# EAGLE design CHIP_dispv1.0 (EAGLE 7.6.0)
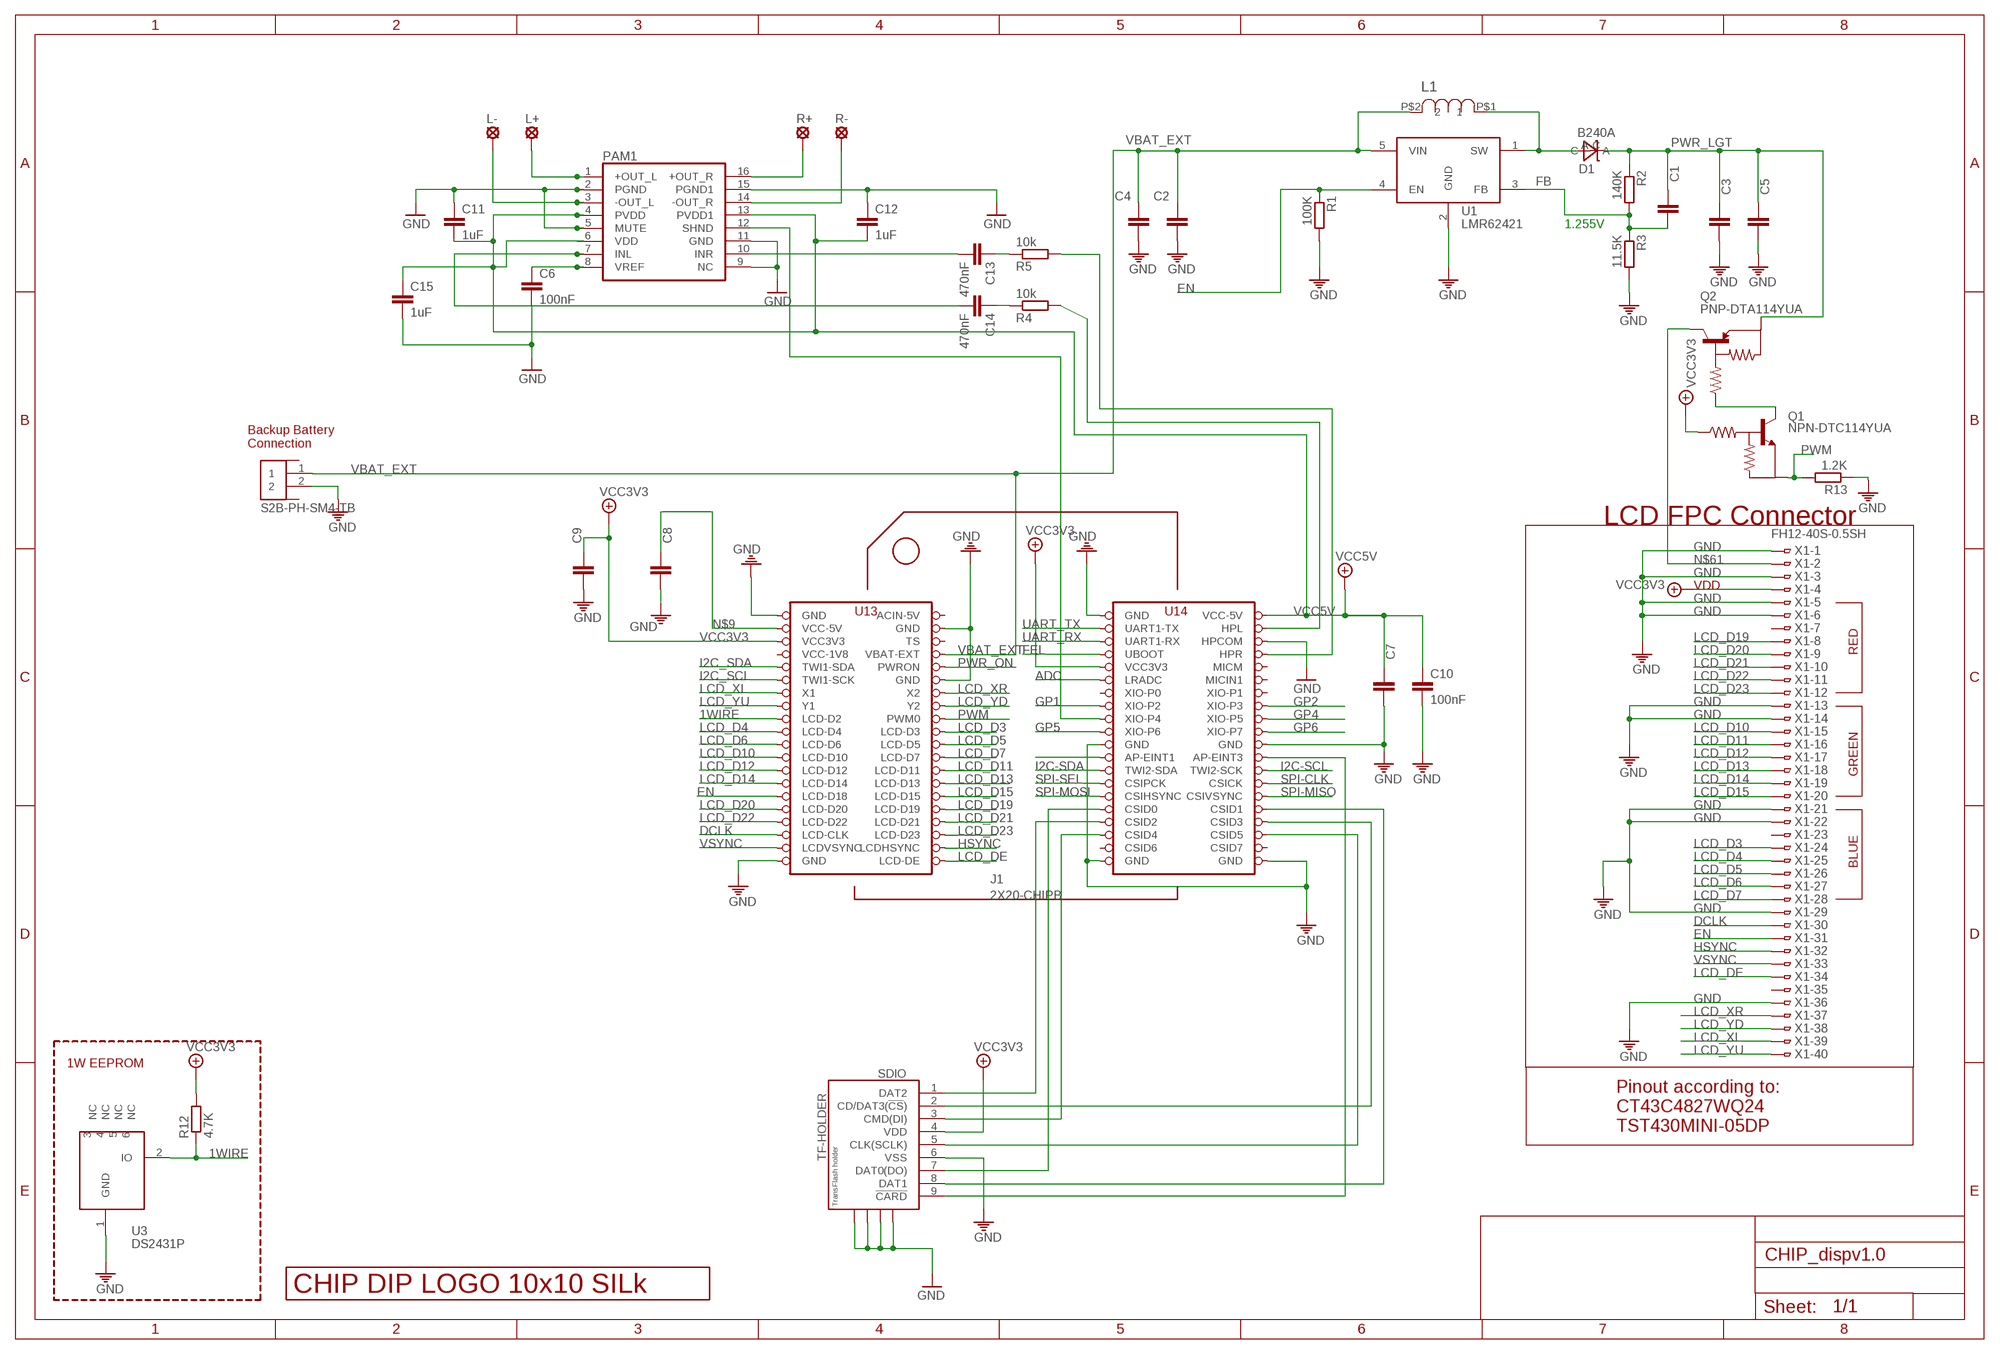
[diagram p0: schematic, sheet 1]

## Parts
C1  220pF  C-EUC0805  [C0805]
C2  100nF  C-EUC0805  [C0805]
C3  100nF  C-EUC0805  [C0805]
C4  22uF  C-EUC0805  [C0805]
C5  22uF  C-EUC0805  [C0805]
C6  100nF  C-EUC0805  [C0805]
C7  22uF  C-EUC0805  [C0805]
C8  100nF  C-EUC0805  [C0805]
C9  100nF  C-EUC0805  [C0805]
C10  100nF  C-EUC0805  [C0805]
C11  1uF  C-EUC0805  [C0805]
C12  1uF  C-EUC0805  [C0805]
C13  470nF  C-EUC0805  [C0805]
C14  470nF  C-EUC0805  [C0805]
C15  1uF  C-EUC0805  [C0805]
D1  B240A  DIODE_SCHTKY_B240  [DO-214AC]
J1  2X20-CHIPB  [2X20CHIP_SM]
J3  S2B-PH-SM4-TB  [S2B-PH-SM4-TB]
L1  SRN6045-100M  [SRN6045]
L+  SE11  [SE11]
L-  SE11  [SE11]
PAM1  PAM8403  [SOP-16]
Q1  NPN-DTC114YUA  [SOT323]
Q2  PNP-DTA114YUA  [SOT323]
R1  100K  R-EU_M0805  [M0805]
R2  140K  R-EU_M0805  [M0805]
R3  11.5K  R-EU_M0805  [M0805]
R4  10k  R-EU_R0805  [R0805]
R5  10k  R-EU_R0805  [R0805]
R12  4.7K  R-EU_M0805  [M0805]
R13  1.2K  R-EU_M0805  [M0805]
R+  SE11  [SE11]
R-  SE11  [SE11]
SDIO  TF-HOLDER  [TF-PULL]
U1  LMR62421  [SOT23-5]
U3  DS2431P  [TSOC6]
U$2  LOGO_10X10_SILK  [LOGO2_10X10_SILK]
X1  FH12-40S-0.5SH  [FH12-40S-0.5SH]

## Nets
1WIRE: J1.LCD-D2 R12.1 U3.2(IO)
ADC: J1.LRADC
DCLK: J1.LCD-CLK X1.30
EN: J1.LCD-D18 R1.1 U1.4(EN) X1.31
FB: C1.2 R2.2 R3.1 U1.3(FB)
FEL: J1.FEL(UBOOT)
GND: C2.2 C3.2 C4.2 C5.2 C6.2 C7.2 C8.2 C9.2 C10.2 C11.1 C12.1 C15.2 J1.GND@1(GND) J1.GND@2(GND) J1.GND@3(GND) J1.GND@4(GND) J1.GND@5(GND) J1.GND@6(GND) J1.GND@7(GND) J1.GND@8(GND) J1.GND@10(GND) J1.HPCOM J3.2 PAM1.2(PGND) PAM1.5(MUTE) PAM1.9(NC) PAM1.11(GND) PAM1.15(PGND1) R1.2 R3.2 R13.1 SDIO.6(VSS) SDIO.S1 SDIO.S2 SDIO.S3 SDIO.S4 U1.2(GND) U3.1(GND) X1.1 X1.3 X1.5 X1.6 X1.13 X1.14 X1.21 X1.22 X1.29 X1.36
GP1: J1.XIO-P2
GP2: J1.XIO-P3
GP3: J1.XIO-P4 PAM1.12(SHND)
GP4: J1.XIO-P5
GP5: J1.XIO-P6
GP6: J1.XIO-P7
HSYNC: J1.LCD-HSYNC(LCDHSYNC) X1.32
I2C-SCL: J1.TWI2-SCK
I2C-SDA: J1.TWI2-SDA
I2C_SCL: J1.TWI1-SCK
I2C_SDA: J1.TWI1-SDA
KPD_INT: J1.AP-EINT1
LCD_D3: J1.LCD-D3 X1.24
LCD_D4: J1.LCD-D4 X1.25
LCD_D5: J1.LCD-D5 X1.26
LCD_D6: J1.LCD-D6 X1.27
LCD_D7: J1.LCD-D7 X1.28
LCD_D10: J1.LCD-D10 X1.15
LCD_D11: J1.LCD-D11 X1.16
LCD_D12: J1.LCD-D12 X1.17
LCD_D13: J1.LCD-D13 X1.18
LCD_D14: J1.LCD-D14 X1.19
LCD_D15: J1.LCD-D15 X1.20
LCD_D19: J1.LCD-D19 X1.8
LCD_D20: J1.LCD-D20 X1.9
LCD_D21: J1.LCD-D21 X1.10
LCD_D22: J1.LCD-D22 X1.11
LCD_D23: J1.LCD-D23 X1.12
LCD_DE: J1.LCD-DE X1.34
LCD_XL: J1.X1 X1.39
LCD_XR: J1.X2 X1.37
LCD_YD: J1.Y2 X1.38
LCD_YU: J1.Y1 X1.40
N$1: J1.CSID0 SDIO.7(DAT0(DO))
N$9: C8.1 J1.VCC5V@0(VCC-5V)
N$25: J1.CSID4 SDIO.3(CMD(DI))
N$27: J1.CSID1 SDIO.8(DAT1)
N$28: J1.CSID3 SDIO.2(CD/DAT3(!CS!))
N$31: J1.CSID2 SDIO.1(DAT2)
N$32: L+.MP PAM1.1(+OUT_L)
N$33: L-.MP PAM1.3(-OUT_L)
N$34: PAM1.16(+OUT_R) R+.MP
N$35: PAM1.14(-OUT_R) R-.MP
N$36: C14.2 PAM1.7(INL)
N$37: J1.HPR R5.2
N$38: C6.1 PAM1.8(VREF)
N$39: C13.2 PAM1.10(INR)
N$40: J1.HPL R4.2
N$41: C13.1 R5.1
N$42: C14.1 R4.1
N$44: J1.CSID5 SDIO.5(CLK(SCLK))
N$45: J1.AP-EINT3 SDIO.9(!CARD)
N$61: Q2.3(OUT) X1.2
N$63: Q1.3(OUT) Q2.1(IN)
PWM: J1.PWM0 Q1.2(GND) R13.2
PWR_LGT: C1.1 C3.1 C5.1 D1.C Q2.2(GND) R2.1
PWR_ON: J1.PWRON
SPI-CLK: J1.CSICK
SPI-MISO: J1.CSIVSYNC
SPI-MOSI: J1.CSIHSYNC
SPI-SEL: J1.CSIPCK
UART_RX: J1.UART1-RX
UART_TX: J1.UART1-TX
VBAT_EXT: C2.1 C4.1 J1.BAT(VBAT-EXT) J3.1 L1.P$2 U1.5(VIN)
VCC3V3: C9.1 J1.VCC3V3 J1.VCC3V3@1(VCC3V3) Q1.1(IN) R12.2 SDIO.4(VDD) X1.4
VCC5V: C7.1 C10.1 C11.2 C12.2 C15.1 J1.VCC5V@1(VCC-5V) PAM1.4(PVDD) PAM1.6(VDD) PAM1.13(PVDD1)
VREG_OUTPUT: D1.A L1.P$1 U1.1(SW)
VSYNC: J1.LCD-VSYNC(LCDVSYNC) X1.33
Unconnected: J1.CHG-IN(ACIN-5V) J1.CSID6 J1.CSID7 J1.MICIN1 J1.MICM J1.TS J1.XIO-P0 J1.XIO-P1 J3.MNT1 J3.MNT2 U3.3(NC) U3.4(NC) U3.5(NC) U3.6(NC) X1.7 X1.23 X1.35

## Notes on the sheet
- 1.255V
- Backup Battery
  Connection
- LCD FPC Connector
- VDD
- RED
- GREEN
- BLUE
- 1W EEPROM
- Pinout according to:
  CT43C4827WQ24
  TST430MINI-05DP

## Power pins joined to a net without a drawn wire
VCC-1V8: J1.VCC1V8(VCC-1V8)

## Library data of the parts
C1-C15 = rcl:C-EU: CAPACITOR, European symbol
D1 = Keyboard v0_5:DIODE_SCHTKY_B240; DESCRIPTION: DIODE SMD General Purpose 400V 1A 1.4W RoHS DO-214AC; FOOTPRINT: DO-214AC; LINK: http://www.digikey.com/product-detail/en/B240A-13-F/B240A-FDICT-ND/717810; MFG: DIGIKEY; MFG_PN: B240A-FDICT-ND; PART_TYPE: DIODE; PRICE: 0.11; VENDOR: DIODES; VENDOR_PART_NUMBER: B240A-13-F
J1 = JKW_CHIP:2X20-CHIP: Through hole layout with chip reference
J3 = Keyboard v0_5:S2B-PH-SM4-TB; DESCRIPTION: 2 pin con, 2MM RA, SMD; FOOTPRINT: S2B-PH-SM4-TB; LINK: http://www.digikey.com/product-detail/en/S2B-PH-SM4-TB(LF)(SN)/455-1749-1-ND/926846; MFG: DIGIKEY; MFG_PN: 455-1749-1-ND; PART_TYPE: CON; PRICE: 0.26; VENDOR: JST; VENDOR_PART_NUMBER: S2B-PH-SM4-TB(LF)(SN)
L1 = Keyboard v0_5:SRN6045-100M; DESCRIPTION: power inductor 10uH 2.5A 58.6 mohm; FOOTPRINT: SRN6045; LINK: http://www.digikey.com/product-detail/en/SRN6045-100M/SRN6045-100MTR-ND/2756120; MFG: DIGIKEY; MFG_PN: SRN6045-100MTR-ND; PART_TYPE: IND; PRICE: 0.15; TOLLERANCE: ±20%; VENDOR: BOURNS; VENDOR_PART_NUMBER: SRN6045-100M
L+ L- R+ R- = solpad:SE11: SOLDER PAD RTM, drill 1,1mm, distributor Buerklin, 07F810
PAM1 = JKW_CHIP:PAM8403: Dual channel audio amplifier IC - PAM8403
Q1 = PocketCHIP-Components-v0.72:NPN-DTC114YUA
Q2 = PocketCHIP-Components-v0.72:PNP-DTA114YUA
R1-R5 R12 R13 = rcl:R-EU_: RESISTOR, European symbol
SDIO = JKW_CHIP:TF-HOLDER: TF / Micro SD socket is PUSH-PUSH type, the card can be pushed into and auto locked and pushed out by simply press the card. Surface Mounting type.
U1 = PocketCHIP-Components-v0.7:LMR62421; DESCRIPTION: dc/dc step up, 2.1A, 1.6mhz, SOT-23-5; FOOTPRINT: SOT23-5; LINK: http://www.digikey.com/product-detail/en/LMR62421XMFE%2FNOPB/LMR62421XMFE%2FNOPBCT-ND/2777085; MFG: DIGIKEY; MFG_PN: LMR62421XMFE/NOPBCT-ND; PART_TYPE: IC; PRICE: 0.8; VENDOR: TEXAS INSTRUMENTS; VENDOR_PART_NUMBER: LMR62421XMFE/NOPB
U3 = Keyboard v0_5:DS2431: 1024-Bit EEPROM This chip provides a 4x256 Bit EEPROM, which can be programmed@5V. Write protection and OTP emulation are available, too. Author: Jan Kandziora <jjj@gmx.de>; DESCRIPTION: IC, 1024-Bit, 1-Wire EEPROM, TSOC6; FOOTPRINT: TSOC6; LINK: http://www.digikey.com/product-detail/en/DS2431P%2BT%26R/DS2431P%2BT%26RCT-ND/3647900; MFG: DIGIKEY; MFG_PN: DS2431P+T&RCT-ND; PART_TYPE: IC; PRICE: 0.98; VENDOR: MAXIM; VENDOR_PART_NUMBER: DS2431P+T&R
U$2 = JKW_CHIP:LOGO_10X10_SILK
X1 = Keyboard v0_5:FH12-40S-0.5S: 0.5mm Pitch Connectors For FPC/FFC Source: Data sheet <http://www.hirose.co.jp/cataloge_hp/e58605370.pdf>; DESCRIPTION: CON ffc smd, bottom contact 40pos, 0.50mm R/A; FOOTPRINT: FH12-40S-0.5SH; LINK: http://www.digikey.com/product-detail/en/FH12-40S-0.5SH(55)/HFJ140CT-ND/1110388; MFG: DIGIKEY; MFG_PN: HFJ140CT-ND; VENDOR: HIROSE; VENDOR_PART_NUMBER: FH12-40S-0.5SH(55)

## Board
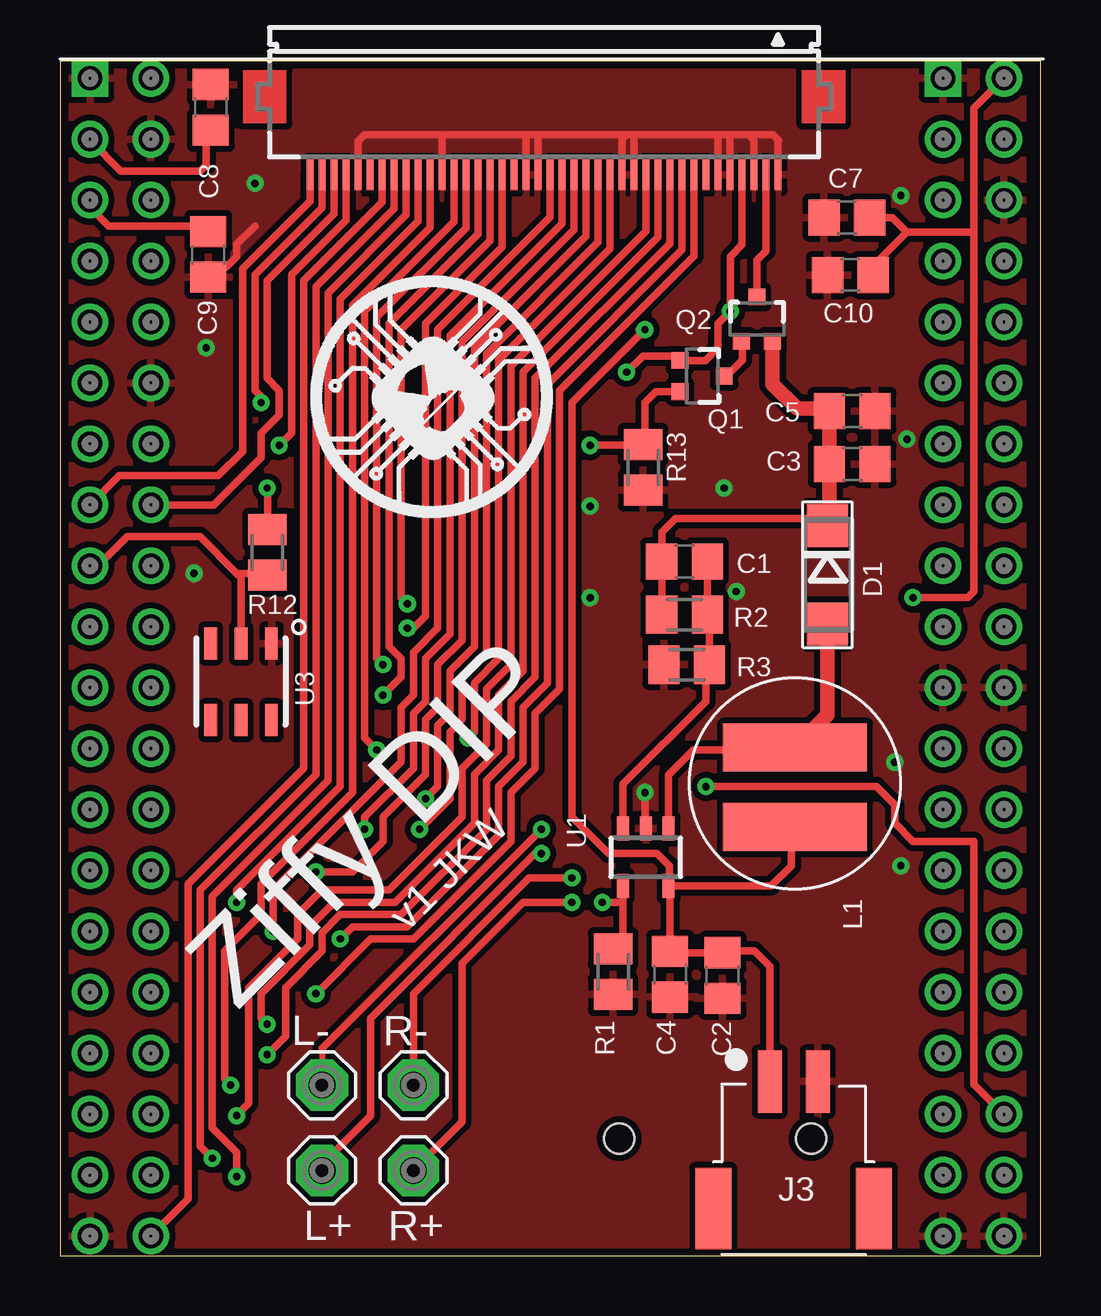
[diagram p1: board, top side]
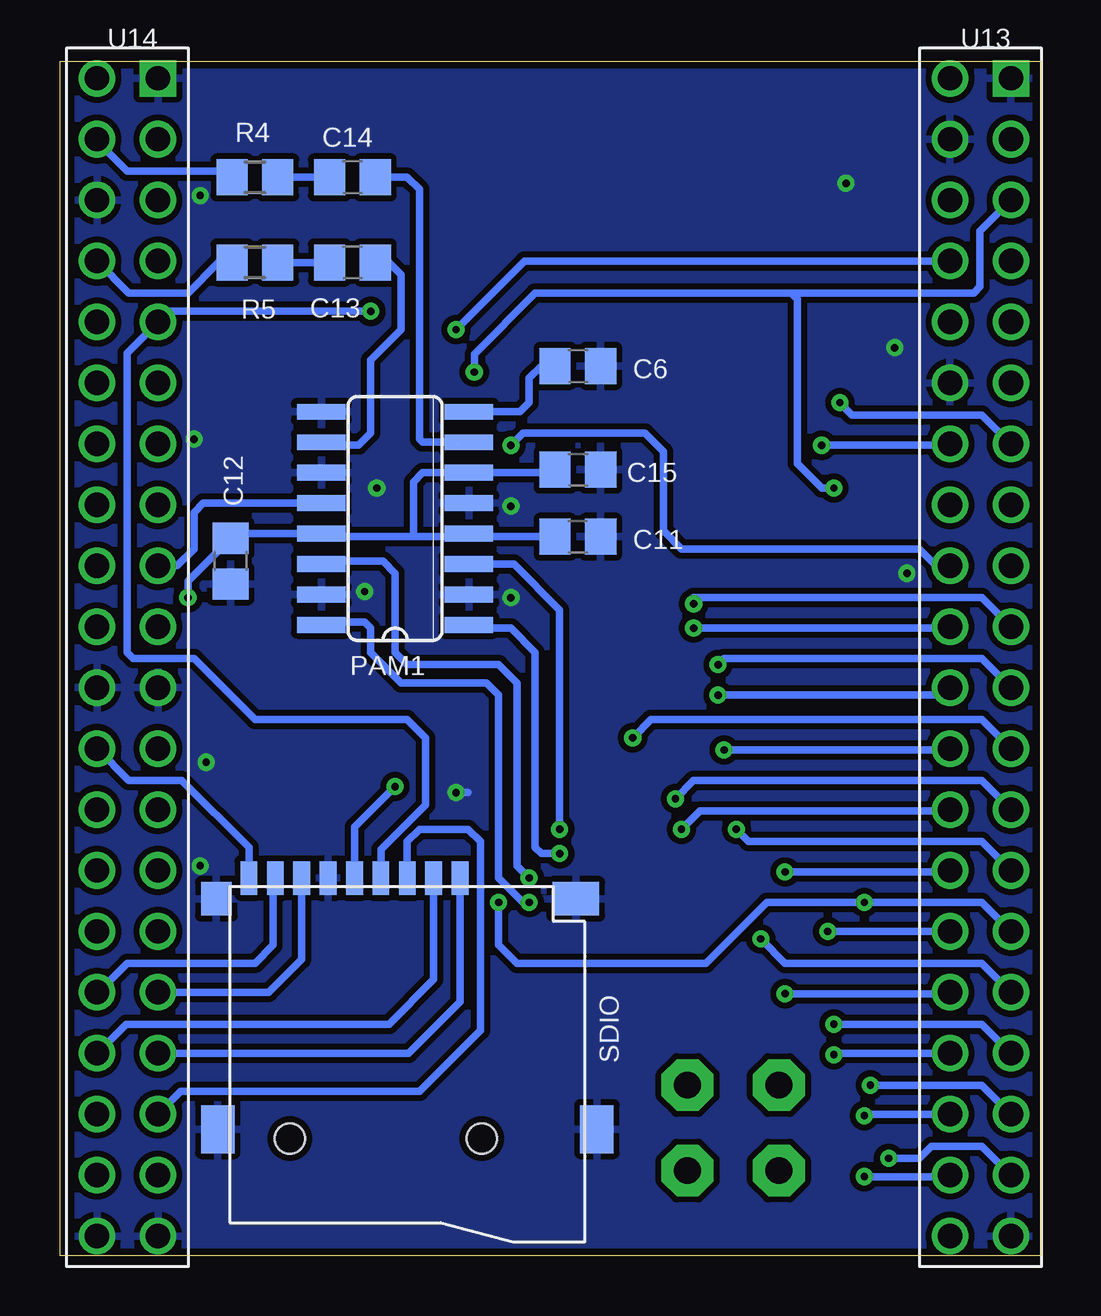
[diagram p2: board, bottom side, seen from below]

Size 40.89 x 49.78 mm. Coordinates in mm from the lower left corner, seen from the top.
Outline: 0,0 40.89,0 40.89,49.78 0,49.78 0,0
Copper layers (1*2*15*16): Top 0.035mm / dielectric 0.2mm / Route2 0.035mm / dielectric 0.2mm / Route15 0.035mm / dielectric 0.2mm / Bottom 0.035mm
Design rules "Hampoo *": minimum track width 3mil, minimum drill 8mil, track to track 3mil, track to pad 3mil, pad to pad 3mil, via to via 3mil, smd to smd 3mil, copper to edge 12mil, drill to drill 8mil, minimum pad ring 10mil, minimum via ring 8mil, stop-mask expansion 4mil, vias tented up to drill 24mil, thermal gap 10mil

### Footprints (pad centres in the part's own frame; a part is rotated, then mirrored left to right if it is on the bottom)
C0805 = smd 1.3 x 1.5: 1 -0.95,0; 2 0.95,0
DO-214AC = smd 1.8 x 1.7: A 2.05,0; C -2.05,0
2X20CHIP_SM = drill 1.016: AP-EINT1 36.81,21.65; AP-EINT3 39.35,21.65; BAT 3.79,41.97; CHG-IN 3.79,49.59; CSICK 39.35,16.57; CSID0 36.81,11.49; CSID1 39.35,11.49; CSID2 36.81,8.95; CSID3 39.35,8.95; CSID4 36.81,6.41; CSID5 39.35,6.41; CSID6 36.81,3.87; CSID7 39.35,3.87; CSIHSYNC 36.81,14.03; CSIPCK 36.81,16.57; CSIVSYNC 39.35,14.03; FEL 36.81,41.97; GND@1 3.79,36.89; GND@2 1.25,1.33; GND@4 39.35,24.19; GND@5 39.35,1.33; GND@6 36.81,1.33; GND@7 36.81,24.19; GND@10 3.79,47.05; HPCOM 39.35,44.51; HPL 39.35,47.05; HPR 39.35,41.97; LCD-CLK 1.25,6.41; LCD-D2 1.25,29.27; LCD-D3 3.79,26.73; LCD-D4 1.25,26.73; LCD-D5 3.79,24.19; LCD-D6 1.25,24.19; LCD-D7 3.79,21.65; LCD-D10 1.25,21.65; LCD-D11 3.79,19.11; LCD-D12 1.25,19.11; LCD-D13 3.79,16.57; LCD-D14 1.25,16.57; LCD-D15 3.79,14.03; LCD-D18 1.25,14.03; LCD-D19 3.79,11.49; LCD-D20 1.25,11.49; LCD-D21 3.79,8.95; LCD-D22 1.25,8.95; LCD-D23 3.79,6.41; LCD-DE 3.79,1.33; LCD-HSYNC 3.79,3.87; LCD-VSYNC 1.25,3.87; LRADC 36.81,36.89; MICIN1 39.35,36.89; MICM 39.35,39.43; PWM0 3.79,29.27; PWRON 3.79,39.43; TS 3.79,44.51; TWI1-SCK 1.25,36.89; TWI1-SDA 1.25,39.43; TWI2-SCK 39.35,19.11; TWI2-SDA 36.81,19.11; UART1-RX 36.81,44.51; UART1-TX 36.81,47.05; VCC1V8 1.25,41.97; VCC3V3 1.25,44.51; VCC3V3@1 36.81,39.43; VCC5V@0 1.25,47.05; VCC5V@1 39.35,49.59; X1 1.25,34.35; X2 3.79,34.35; XIO-P0 36.81,34.35; XIO-P1 39.35,34.35; XIO-P2 36.81,31.81; XIO-P3 39.35,31.81; XIO-P4 36.81,29.27; XIO-P5 39.35,29.27; XIO-P6 36.81,26.73; XIO-P7 39.35,26.73; Y1 1.25,31.81; Y2 3.79,31.81 | drill 1.016 square: GND@3 1.25,49.59; GND@8 36.81,49.59
S2B-PH-SM4-TB = smd 2.6 x 1: 1 0,-1; 2 0,1 | smd 3.4 x 1.5: MNT1 5.3,3.35; MNT2 5.3,-3.35
SRN6045 = smd 2 x 6: P$1 1.5,0; P$2 -1.8,0
SE11 = drill 1.118 pad 2.159 octagon: MP 0,0
SOP-16 = smd 0.66 x 2.032: 1 -4.445,-3.073; 2 -3.175,-3.073; 3 -1.905,-3.073; 4 -0.635,-3.073; 5 0.635,-3.073; 6 1.905,-3.073; 7 3.175,-3.073; 8 4.445,-3.073; 9 4.445,3.073; 10 3.175,3.073; 11 1.905,3.073; 12 0.635,3.073; 13 -0.635,3.073; 14 -1.905,3.073; 15 -3.175,3.073; 16 -4.445,3.073
SOT323 = smd 0.7 x 0.7: 1 -0.65,-0.925; 2 0.65,-0.925; 3 0,0.925
M0805 = smd 1.3 x 1.6: 1 -0.95,0; 2 0.95,0
R0805 = smd 1.3 x 1.5: 1 -0.95,0; 2 0.95,0
TF-PULL = smd 0.7 x 1.4: 1 -2.2,-7.62; 2 -1.1,-7.62; 3 0,-7.62; 4 1.1,-7.62; 5 2.2,-7.62; 6 3.3,-7.62; 7 4.4,-7.62; 8 5.5,-7.62; 9 6.6,-7.62 | smd 1.4 x 2: S1 -7.9,2.85; S2 7.9,2.85 | smd 1.28 x 1.4: S3 7.96,-6.75 | smd 1.95 x 1.4: S4 -7.025,-6.75 | hole 1.25: -3.1,3.25; 4.9,3.25
SOT23-5 = smd 0.5 x 1: 1 -0.95,-1.2; 2 0,-1.2; 3 0.95,-1.2; 4 0.95,1.2; 5 -0.95,1.2
TSOC6 = smd 0.53 x 1.33: 1 -1.27,-1.6; 2 0,-1.6; 3 1.27,-1.6; 4 1.27,1.6; 5 0,1.6; 6 -1.27,1.6
FH12-40S-0.5SH = smd 0.3 x 1.3: 1 -9.75,3.25; 2 -9.25,3.25; 3 -8.75,3.25; 4 -8.25,3.25; 5 -7.75,3.25; 6 -7.25,3.25; 7 -6.75,3.25; 8 -6.25,3.25; 9 -5.75,3.25; 10 -5.25,3.25; 11 -4.75,3.25; 12 -4.25,3.25; 13 -3.75,3.25; 14 -3.25,3.25; 15 -2.75,3.25; 16 -2.25,3.25; 17 -1.75,3.25; 18 -1.25,3.25; 19 -0.75,3.25; 20 -0.25,3.25; 21 0.25,3.25; 22 0.75,3.25; 23 1.25,3.25; 24 1.75,3.25; 25 2.25,3.25; 26 2.75,3.25; 27 3.25,3.25; 28 3.75,3.25; 29 4.25,3.25; 30 4.75,3.25; 31 5.25,3.25; 32 5.75,3.25; 33 6.25,3.25; 34 6.75,3.25; 35 7.25,3.25; 36 7.75,3.25; 37 8.25,3.25; 38 8.75,3.25; 39 9.25,3.25; 40 9.75,3.25

### Placement (x,y rotation side)
C1  26.04,28.94 0 top
C2  27.62,11.68 270 top
C3  33.02,33 0 top
C4  25.43,11.73 270 top
C5  33.02,35.21 0 top
C6  19.3,37.08 0 bottom
C7  32.8,43.27 180 top
C8  6.29,47.87 90 top
C9  6.18,41.74 270 top
C10  32.95,40.88 180 top
C11  19.3,29.97 180 bottom
C12  33.78,28.96 90 bottom
C13  28.7,41.4 0 bottom
C14  28.7,44.96 0 bottom
C15  19.3,32.77 0 bottom
D1  31.99,28.38 270 top
J1  0,-0.51 0 top
J3  30.59,7.26 270 top
L1  30.64,19.68 90 top
L+  10.92,3.56 180 top
L-  10.92,7.11 0 top
PAM1  26.92,30.73 90 bottom
Q1  26.76,36.67 270 top
Q2  29.05,39.04 0 top
R1  23.06,11.84 270 top
R2  26.04,26.73 0 top
R3  26.13,24.64 180 top
R4  32.77,44.96 180 bottom
R5  32.77,41.4 180 bottom
R12  8.65,29.32 90 top
R13  24.31,32.86 90 top
R+  14.73,3.56 180 top
R-  14.73,7.11 0 top
SDIO  26.42,8.13 180 bottom
U1  24.42,16.61 180 top
U3  7.55,23.93 180 top
U$2  15.49,28.7 45 top
X1  20.18,48.31 180 top

### Tracks (layer width: path | path; a pad name or v marks a point on that pad's centre or on a via)
1WIRE
  Top 0.305: J1.LCD-D2 1.58,28.76 2.79,29.97 5.84,29.97 7.37,28.45 | 7.37,28.45 8.57,28.45 R12.1 | U3.2 7.55,28.27 7.37,28.45
DCLK  (via drill 0.3)
  Top 0.305: X1.30 15.43,42.86 12.19,39.62 12.19,19.3 8.38,15.49 8.38,14.22 6.86,12.7 6.86,7.37 v7.11,7.11
  Bottom 0.305: v7.11,7.11 2.46,7.11 J1.LCD-CLK
EN  (via drill 0.3)
  Top 0.305: X1.31 14.93,43.12 11.68,39.88 11.68,19.56 7.37,15.24 v7.37,14.73 | R1.1 23.47,13.21 23.47,14.73 | 23.47,14.73 U1.4 | v22.61,14.73 23.47,14.73
  Bottom 0.305: J1.LCD-D18 2.46,14.73 v7.37,14.73 11.43,14.73 13.97,12.19 21.84,12.19 22.61,12.95 v22.61,14.73
FB
  Top 0.305: U1.3 23.47,19.66 26.92,23.11 26.92,24.48 R3.1 27.08,26.63 R2.2 C1.2
GND  (via drill 0.3)
  Top 0.305: X1.29 15.93,46.66 | 15.93,46.66 16,46.74 19.3,46.74 | 19.3,46.74 20.07,46.74 | 20.07,46.74 23.62,46.74 | 23.62,46.74 23.88,46.74 | 23.88,46.74 27.43,46.74 | 27.43,46.74 27.94,46.74 | 27.94,46.74 28.7,46.74 | 28.7,46.74 29.72,46.74 29.97,46.48 29.93,46.44 X1.1 | X1.3 28.93,46.51 28.7,46.74 | X1.6 27.43,46.73 27.43,46.74 | X1.5 27.93,46.73 27.94,46.74 | X1.14 23.43,46.54 23.62,46.74 | X1.13 23.93,46.68 23.88,46.74 | X1.22 19.43,46.61 19.3,46.74 | X1.21 19.93,46.6 20.07,46.74 | X1.36 12.43,46.47 12.7,46.74 15.86,46.74 15.93,46.66 | U1.2 24.38,17.84 v24.38,19.3 | C9.2 6.5,40.79 7.37,41.66 7.37,42.16 8.13,42.93
  Bottom 0.305: v24.38,19.3 23.88,19.3
  other vias: 34.8,20.57 27.69,32 5.59,28.45 6.1,37.85 28.19,27.69 35.31,34.04 22.1,31.24 22.1,27.43 8.13,44.7 35.05,16.26 35.05,44.2
  pour Bottom (isolate 0.254): 0.51,49.78 40.13,49.78 40.13,39.12 40.13,0.25 6.6,0.25 0.51,0.25
  pour Top (isolate 0.254): 0.51,49.78 40.13,49.78 40.13,45.21 40.13,0.25 32.51,0.25 0.51,0.25
GP3
  Bottom 0.305: PAM1.12 34.92,31.37 35.31,30.99 35.31,29.46 36.01,28.76 J1.XIO-P4
HSYNC  (via drill 0.3)
  Top 0.305: X1.32 14.43,43.39 11.18,40.13 11.18,19.81 6.35,14.99 6.35,5.33 7.37,4.32 v7.37,3.3
  Bottom 0.305: v7.37,3.3 3.85,3.3 J1.LCD-HSYNC
LCD_D3  (via drill 0.3)
  Top 0.305: X1.24 18.43,42.05 15.24,38.86 15.24,26.67 14.73,26.16 v14.48,26.16
  Bottom 0.305: v14.48,26.16 3.85,26.16 J1.LCD-D3
LCD_D4  (via drill 0.3)
  Top 0.305: X1.25 17.93,42.31 14.22,38.61 14.22,27.43 v14.48,27.18
  Bottom 0.305: v14.48,27.18 14.48,27.43 2.46,27.43 J1.LCD-D4
LCD_D5  (via drill 0.3)
  Top 0.305: X1.26 17.43,42.58 13.72,38.86 13.72,25.4 14.22,24.89 14.22,24.13 v13.46,23.37
  Bottom 0.305: v13.46,23.37 4.1,23.37 J1.LCD-D5
LCD_D6  (via drill 0.3)
  Top 0.305: X1.27 16.93,42.84 13.21,39.12 13.21,24.89 v13.46,24.64
  Bottom 0.305: v13.46,24.64 13.21,24.89 2.46,24.89 J1.LCD-D6
LCD_D7  (via drill 0.3)
  Top 0.305: X1.28 16.43,43.1 12.7,39.37 12.7,21.59 v13.21,21.08
  Bottom 0.305: v13.21,21.08 3.85,21.08 J1.LCD-D7
LCD_D10  (via drill 0.3)
  Top 0.305: X1.15 22.93,41.98 18.29,37.34 18.29,24.89 17.27,23.88 17.27,21.84 v17.02,21.59
  Bottom 0.305: v17.02,21.59 16.26,22.35 2.46,22.35 J1.LCD-D10
LCD_D11  (via drill 0.3)
  Top 0.305: X1.16 22.43,42.24 17.78,37.59 17.78,25.15 16.76,24.13 16.76,22.35 16.26,21.84 16.26,19.05 v14.99,17.78
  Bottom 0.305: v14.99,17.78 14.22,18.54 3.85,18.54 J1.LCD-D11
LCD_D12  (via drill 0.3)
  Top 0.305: X1.17 21.93,42.5 17.27,37.85 17.27,25.4 16.26,24.38 16.26,22.61 15.75,22.1 15.75,19.56 v15.24,19.05
  Bottom 0.305: v15.24,19.05 14.48,19.81 2.46,19.81 J1.LCD-D12
LCD_D13  (via drill 0.3)
  Top 0.305: X1.18 21.43,42.77 16.76,38.1 16.76,25.65 15.75,24.64 15.75,22.86 15.24,22.35 15.24,20.83 15.24,20.32 15.24,20.07 13.46,18.29 13.46,17.27 12.19,16 v10.67,16
  Bottom 0.305: J1.LCD-D13 3.85,16 v10.67,16
LCD_D14  (via drill 0.3)
  Top 0.305: X1.19 20.93,43.03 16.26,38.35 16.26,25.91 15.24,24.89 15.24,23.11 14.73,22.61 14.73,20.32 12.7,18.29 v12.7,17.78
  Bottom 0.305: v12.7,17.78 12.19,17.27 2.46,17.27 J1.LCD-D14
LCD_D15  (via drill 0.3)
  Top 0.305: X1.20 20.43,43.29 15.75,38.61 15.75,26.16 14.73,25.15 14.73,23.37 14.22,22.86 14.22,20.57 8.89,15.24 v8.89,13.52
  Bottom 0.305: v8.89,13.52 J1.LCD-D15
LCD_D19  (via drill 0.3)
  Top 0.305: X1.8 26.43,41.67 20.83,36.07 20.83,23.62 19.81,22.61 19.81,20.32 18.8,19.3 18.8,17.27 14.73,13.21 12.95,13.21 v10.67,10.92
  Bottom 0.305: v10.67,10.92 3.85,10.92 J1.LCD-D19
LCD_D20  (via drill 0.3)
  Top 0.305: X1.9 25.93,41.93 20.32,36.32 20.32,23.88 19.3,22.86 19.3,20.57 18.29,19.56 18.29,17.53 14.48,13.72 12.19,13.72 v11.68,13.21
  Bottom 0.305: J1.LCD-D20 2.46,12.19 10.67,12.19 v11.68,13.21
LCD_D21  (via drill 0.3)
  Top 0.305: X1.10 25.43,42.19 19.81,36.58 19.81,24.13 18.8,23.11 18.8,20.83 17.78,19.81 17.78,17.78 14.22,14.22 11.68,14.22 10.92,13.46 10.92,12.7 9.4,11.18 9.4,9.14 v8.64,8.38
  Bottom 0.305: v8.64,8.38 8.58,8.44 J1.LCD-D21
LCD_D22  (via drill 0.3)
  Top 0.305: X1.11 24.93,42.46 19.3,36.83 19.3,24.38 18.29,23.37 18.29,21.08 17.27,20.07 17.27,18.03 13.97,14.73 11.43,14.73 10.41,13.72 10.41,12.95 8.38,10.92 8.38,9.91 v8.64,9.65
  Bottom 0.305: J1.LCD-D22 2.46,9.65 v8.64,9.65
LCD_D23  (via drill 0.3)
  Top 0.305: X1.12 24.43,42.72 18.8,37.08 18.8,24.64 17.78,23.62 17.78,21.34 16.76,20.32 16.76,18.29 13.72,15.24 10.92,15.24 9.91,14.22 9.91,13.21 9.65,12.95 9.4,12.7 7.87,11.18 7.87,6.35 v7.37,5.84
  Bottom 0.305: 3.85,5.84 J1.LCD-D23 7.31,5.9 v7.37,5.84
LCD_DE
  Top 0.305: 3.85,0.76 J1.LCD-DE 5.33,2.37 5.33,15.49 10.16,20.32 10.16,40.64 13.43,43.91 X1.34
LCD_XL  (via drill 0.3)
  Top 0.305: X1.39 10.93,43.7 8.13,40.89 8.13,36.07 8.38,35.81 v8.38,35.56
  Bottom 0.305: v8.38,35.56 7.87,35.05 2.46,35.05 J1.X1
LCD_XR  (via drill 0.3)
  Top 0.305: X1.37 11.93,43.17 9.65,40.89 9.65,34.29 v9.14,33.78
  Bottom 0.305: v9.14,33.78 3.85,33.78 J1.X2
LCD_YD
  Top 0.305: X1.38 11.43,43.43 8.64,40.64 8.64,36.58 9.14,36.07 9.14,35.05 8.38,34.29 8.38,33.27 6.41,31.3 J1.Y2
LCD_YU
  Top 0.305: J1.Y1 2.46,32.51 6.6,32.51 7.62,33.53 7.62,41.15 10.43,43.96 X1.40
N$1
  Bottom 0.305: J1.CSID0 32.2,10.98 30.82,12.36 SDIO.7
N$9
  Top 0.305: J1.VCC5V@0 1.25,46.5 2.54,45.21 5.84,45.21 6.1,45.47 6.1,46.72 C8.1
N$25
  Bottom 0.305: J1.CSID4 35.85,6.86 25.91,6.86 23.37,9.4 23.37,17.27 23.88,17.78 25.91,17.78 26.42,17.27 SDIO.3
N$27
  Bottom 0.305: J1.CSID1 39.31,10.98 38.1,12.19 32.77,12.19 32,12.95 32,15.66 SDIO.8
N$28
  Bottom 0.305: J1.CSID3 38.14,9.65 27.18,9.65 25.32,11.51 SDIO.2
N$31
  Bottom 0.305: J1.CSID2 26.36,8.44 24.22,10.58 SDIO.1
N$32  (via drill 0.3)
  Top 0.305: v20.07,16.76 19.81,16.76 12.95,9.91 12.95,5.84 10.92,3.81 L+.MP
  Bottom 0.305: v20.07,16.76 20.83,16.76 21.08,17.02 21.08,25.15 22.1,26.16 23.72,26.16 PAM1.1
N$33  (via drill 0.3)
  Top 0.254: 10.92,8.64 L-.MP
  Top 0.305: 10.92,8.64 v20.07,17.78
  Bottom 0.305: v20.07,17.78 20.07,26.92 21.97,28.83 PAM1.3
N$34  (via drill 0.3)
  Top 0.305: v21.34,14.73 19.3,14.73 16.76,12.19 16.76,5.59 R+.MP
  Bottom 0.305: v21.34,14.73 21.59,14.73 22.61,15.75 22.61,23.37 23.11,23.88 26.67,23.88 27.94,25.15 27.94,26.16 28.19,26.42 29.87,26.42 PAM1.16
N$35  (via drill 0.3)
  Top 0.305: v21.34,15.75 19.56,15.75 14.73,10.92 R-.MP
  Bottom 0.305: v21.34,15.75 21.84,16.26 21.84,23.88 22.61,24.64 26.42,24.64 26.92,25.15 26.92,28.45 27.43,28.96 29.87,28.96 PAM1.14
N$36
  Bottom 0.305: PAM1.7 25.78,33.91 25.91,34.04 25.91,44.45 26.42,44.96 C14.2
N$37
  Bottom 0.305: 39.31,41.46 J1.HPR 38.02,40.13 35.56,40.13 34.29,41.4 R5.2
N$38
  Bottom 0.305: PAM1.8 21.72,35.18 21.34,35.56 21.34,36.58 20.83,37.08 C6.1
N$39
  Bottom 0.305: C13.2 27.18,41.4 26.67,40.89 26.67,38.61 27.94,37.34 27.94,34.29 28.45,33.78 29.87,33.78 PAM1.10
N$40
  Bottom 0.305: J1.HPL 39.35,46.46 38.1,45.21 33.97,45.21 R4.2
N$41
  Bottom 0.305: R5.1 C13.1
N$42
  Bottom 0.305: R4.1 C14.1
N$44  (via drill 0.3)
  Top 0.305: J1.CSID5 38.1,7.15 38.1,17.27 35.56,17.27 34.8,18.03 34.8,18.8 34.04,19.56 v26.92,19.56
  Bottom 0.305: SDIO.5 28.62,17.87 v26.92,19.56
N$45
  Bottom 0.305: SDIO.9 33.02,17.01 35.81,19.81 38.02,19.81 J1.AP-EINT3
N$61
  Top 0.305: X1.2 29.43,41.88 29.05,41.5 Q2.3
N$63
  Top 0.305: Q1.3 27.78,36.67 28.45,37.34 28.45,38.07 Q2.1
PWM  (via drill 0.3)  (1 unrouted)
  Top 0.305: Q1.2 24.84,36.02 24.38,35.56 24.38,33.89 R13.2 24.28,33.78 v22.1,33.78
  Bottom 0.305: J1.PWM0 4.38,28.76 5.08,29.46 14.99,29.46 15.75,30.23 15.75,33.53 16.51,34.29 21.59,34.29 v22.1,33.78 | 24.28,33.78 R13.2
PWR_LGT
  Top 0.305: R2.1 C1.1 25.08,30.17 25.65,30.73 31.69,30.73 D1.C
  Top 0.61: Q2.2 29.7,36.34 30.73,35.31 31.98,35.31 C5.1 C3.1 32.07,30.51 D1.C
VBAT_EXT  (via drill 0.3)
  Top 0.305: J3.1 29.59,12.07 28.96,12.7 27.68,12.7 C2.1 25.48,12.63 C4.1 25.43,15.34 U1.5 | U1.5 29.63,15.41 30.48,16.26 30.48,17.73 L1.P$2 | 24.13,38.61 v24.38,38.61 21.34,35.56 21.34,18.29 22.86,16.76 24.89,16.76 25.4,16.26 25.4,15.44 U1.5
  Bottom 0.305: J1.BAT 21.53,41.46 v24.38,38.61
VCC3V3  (via drill 0.3)
  Top 0.305: X1.4 28.43,42.15 27.94,41.66 v27.94,39.37 27.43,38.86 27.43,37.85 26.91,37.32 Q1.1 25.65,37.51 24.3,37.51 v23.62,36.83 | J1.VCC3V3 1.25,43.71 2.03,42.93 5.94,42.93 C9.1 | R12.2 8.65,31.99 v8.64,32
  Bottom 0.305: v27.94,39.37 36.36,39.37 J1.VCC3V3@1 38.1,37.63 38.1,25.15 37.85,24.89 35.31,24.89 32.77,22.35 26.42,22.35 25.65,21.59 25.65,18.8 27.52,16.93 SDIO.4 | v23.62,36.83 23.62,37.59 21.08,40.13 10.41,40.13 | 10.41,40.13 2.79,40.13 2.54,40.39 2.54,42.71 J1.VCC3V3 | v8.64,32 9.14,32 10.16,33.02 10.16,39.88 10.41,40.13
VCC5V  (via drill 0.3)
  Top 0.305: J1.VCC5V@1 38.1,47.83 38.1,42.67 | 38.1,42.67 38.1,27.69 37.85,27.43 v35.56,27.43 | C7.1 34.71,43.27 35.31,42.67 | 35.31,42.67 38.1,42.67 | C10.1 33.9,41.26 35.31,42.67
  Bottom 0.305: C11.2 23.72,29.97 | 23.72,29.97 PAM1.4 | C15.1 20.38,32.64 PAM1.6 25.78,32.64 26.16,32.26 26.16,29.97 | v35.56,27.43 35.56,28.13 C12.2 33.59,30.1 PAM1.13 29.87,29.97 26.16,29.97 | 26.16,29.97 23.72,29.97
VREG_OUTPUT
  Top 0.305: U1.1 25.37,20.03 26.42,21.08 30.54,21.08 L1.P$1
  Top 0.61: D1.A 31.99,22.54 L1.P$1
VSYNC  (via drill 0.3)
  Top 0.305: X1.33 13.93,43.65 10.67,40.39 10.67,20.07 5.84,15.24 5.84,4.57 v6.35,4.06
  Bottom 0.305: J1.LCD-VSYNC 2.46,4.57 4.57,4.57 5.08,4.06 v6.35,4.06

### Text on the board
tNames: v1 JKW | Ziffy DIP